# Altium schematic sheet PATHOS_PowerSwitch.SchDoc: Power Switch Schematic
size A4; Author: A. Kalberer; CompanyName: NTB; Organization: NTB Interstate University of Applied; Address1: Werdenbergstrasse 4; Address3: 9471 Buchs; Address4: Switzerland; Organization1: Sciences of Technology Buchs; Size: A4; ShortDescription: Power-, Reset-, Recovery-Circuit
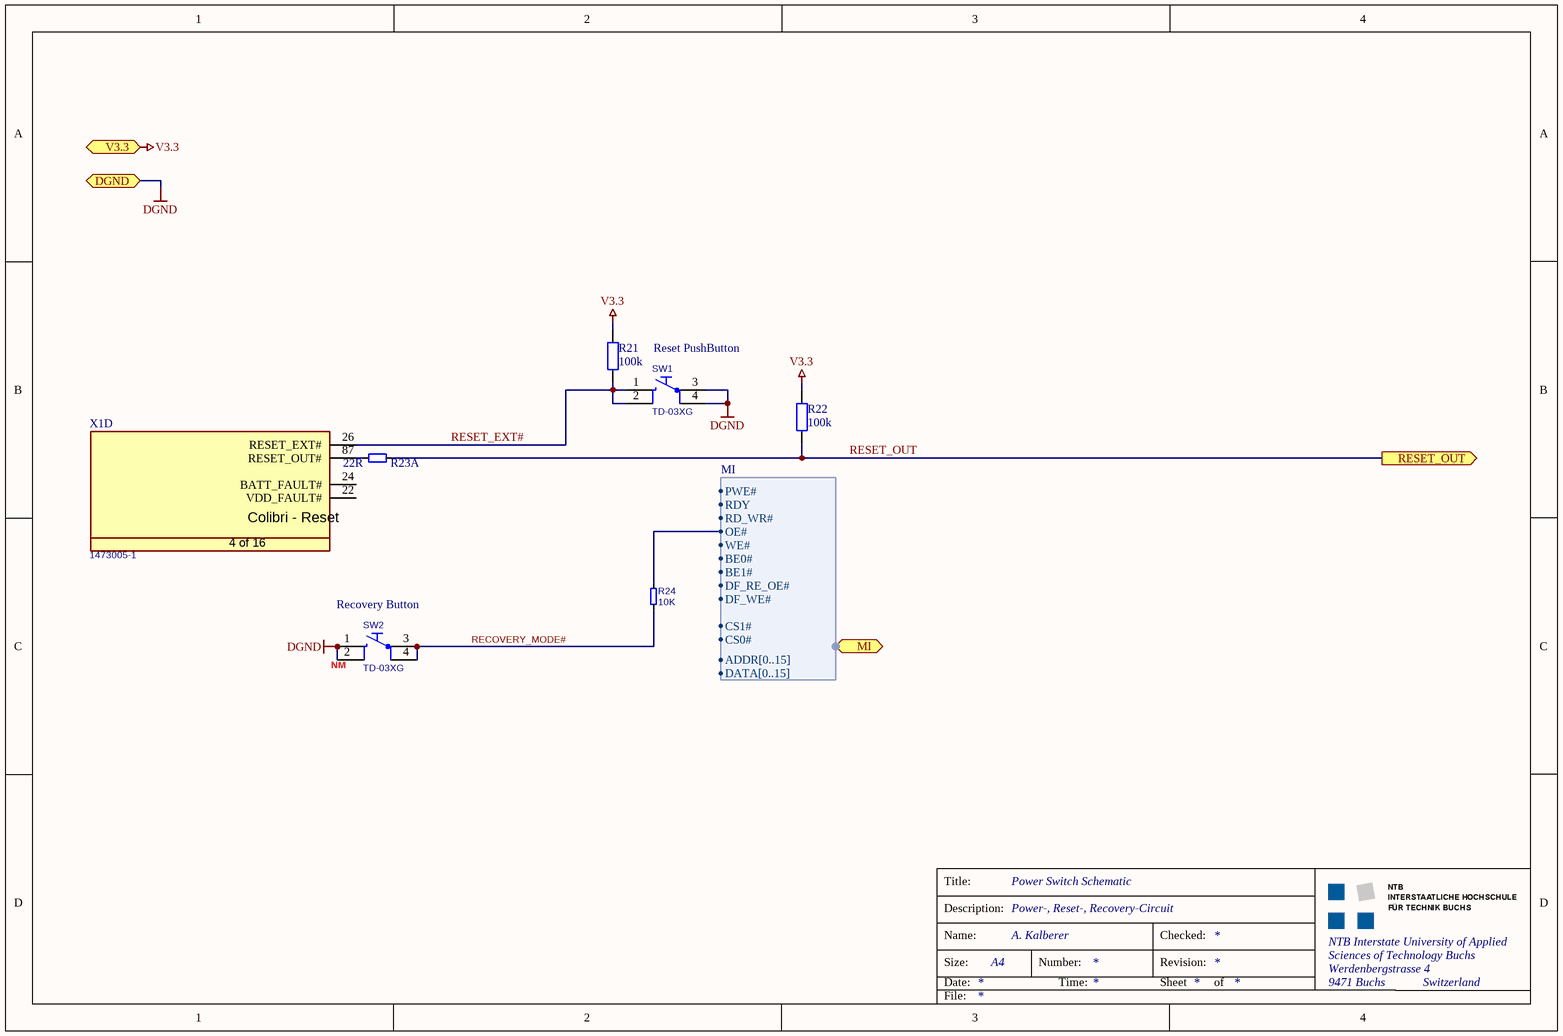
[diagram p0: PATHOS_PowerSwitch.SchDoc]

## Parts
R21  100k  [0603_3D]
R22  100k  [0603_3D]
R23  value 22R  [R_Array_CAT16-J4]  (hidden comment: R Array)  (part A of 4)
R24  10K  [0603_3D]
SW1  TD-03XG  [T_WMF_TD-03XG]
SW2  TD-03XG  [T_WMF_TD-03XG]
X1  Manufacturer Part No.: 1473005-1  [T_Tyco_1473005-1]  (hidden comment: CON-Tyco-1473005-1-200-0.6mm)  (part D of 16)

## Ports
DGND, MI (harness MI), RESET_OUT (out), V3.3

## Harnesses
MI: DATA[0..15], ADDR[0..15], CS0#, DF_WE#, DF_RE_OE#, BE1#, BE0#, WE#, OE#, RD_WR#, RDY, PWE#, CS1#

## Nets
DGND: SW1.3 SW1.4 SW2.1 SW2.2 ; port DGND
V3.3: R21.2 R22.2 ; port V3.3
RECOVERY_MODE#: R24.1 SW2.3 SW2.4
RESET_EXT#: R21.1 SW1.1 SW1.2 X1.26(RESET_EXT#)
RESET_OUT: R22.1 R23.1A ; port RESET_OUT
NetR23_2A: R23.2A X1.87(RESET_OUT#)
NetR24_2: R24.2 ; port MI.OE#

Not connected (* = marked no-connect by the designer): X1 22(VDD_FAULT#) 24(BATT_FAULT#)

## Notes on the sheet
- Reset PushButton
- (near SW2) Recovery Button
- (near SW2) NM
- Title:
- Description:
- Size:
- Date:
- Name:
- Number:
- Time:
- Revision:
- Sheet
- Checked:
- of
- File:
- (in symbol CON-Tyco-1473005-1-200-0.6mm, part D) Colibri - Reset; 4 of 16

## Library data of the parts
R21 R22 = R: Resistor; #Manufacturer: Generic Components; #Publisher: Dr. A. Heinzelmann; #Class: Passive; #Published: 2006-10-06; #ClassSub: Resistor; Type: *; Value: 100k
R23 = R_Array
R24 = R-10KR-63mW-5%-0603: Resistor 10 Kohm 63mW 5% 0603; Value: 10KR; Rating: 63mW; Tolerance: 5%
SW1 SW2 = SW-WMF-TD-03XG: Switch; Manufacturer Name: WMF; Rating: 50mA; Manufacturer Part No.: TD-03XG
X1 = CON-Tyco-1473005-1-200-0.6mm: SODIMM Connector; Manufacturer Name: Tyco; No. of ways: 200